# Altium project 28Pins_Project_v1.PrjPcb (part 1 of 3)
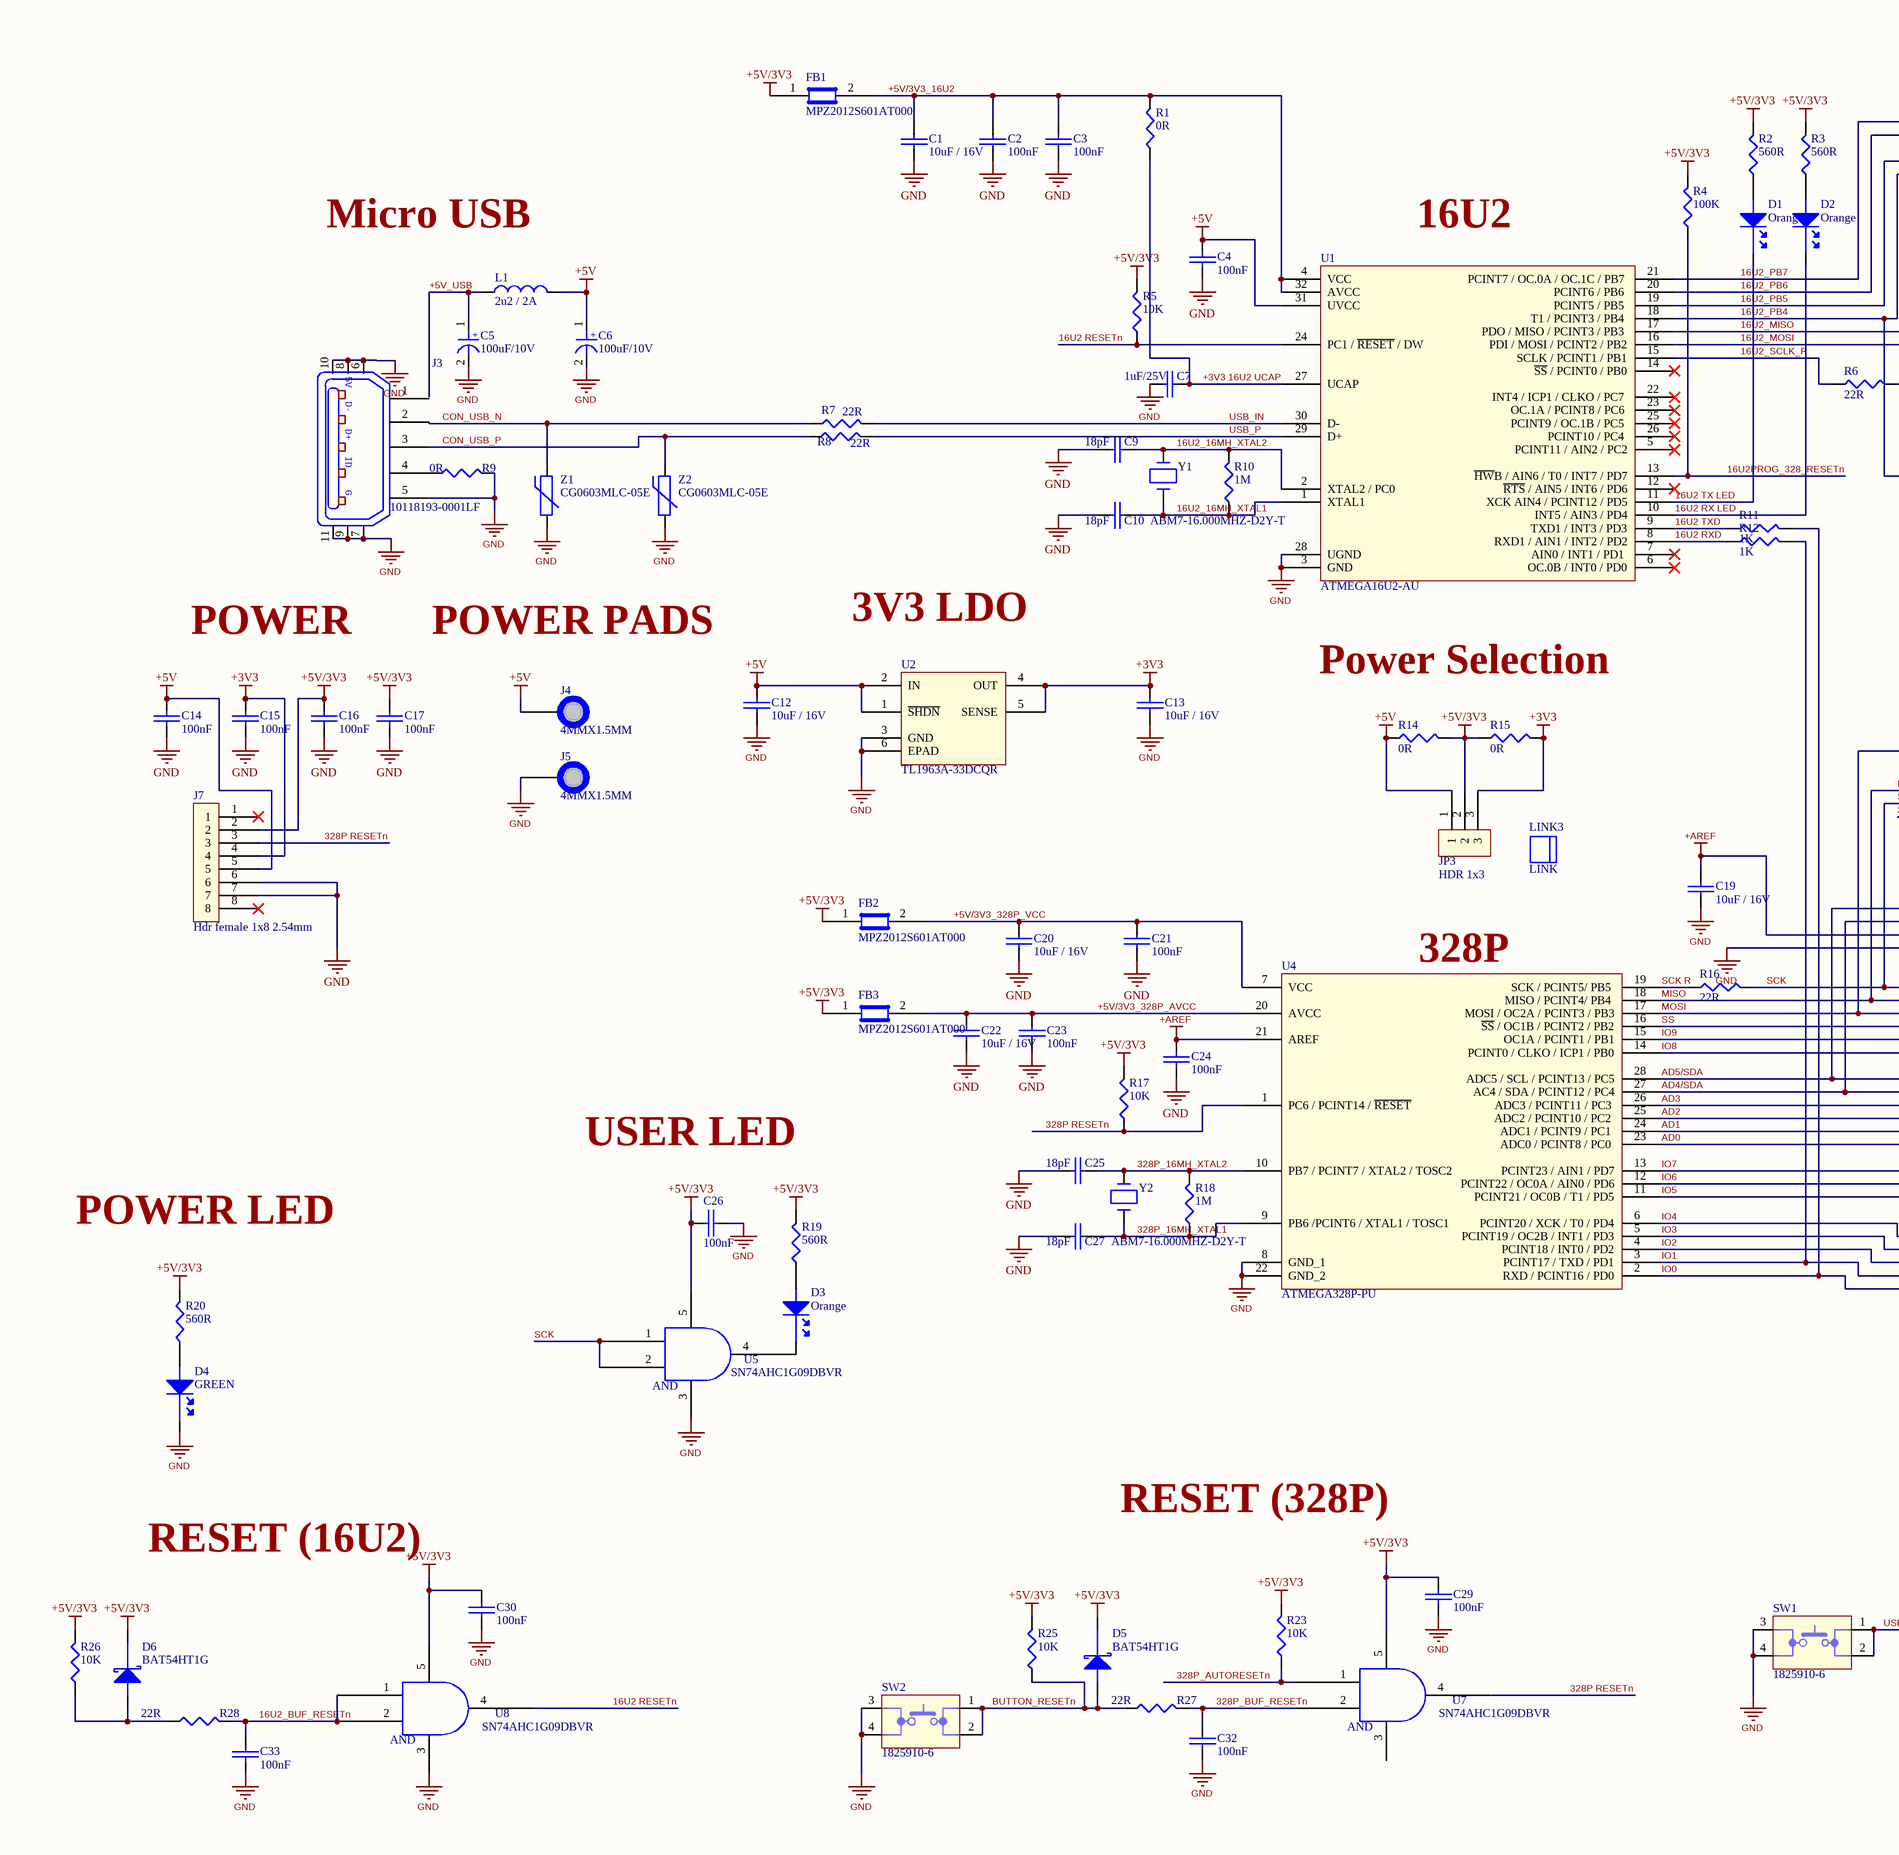
[diagram p0: 28Pins_Schematic.SchDoc, left]
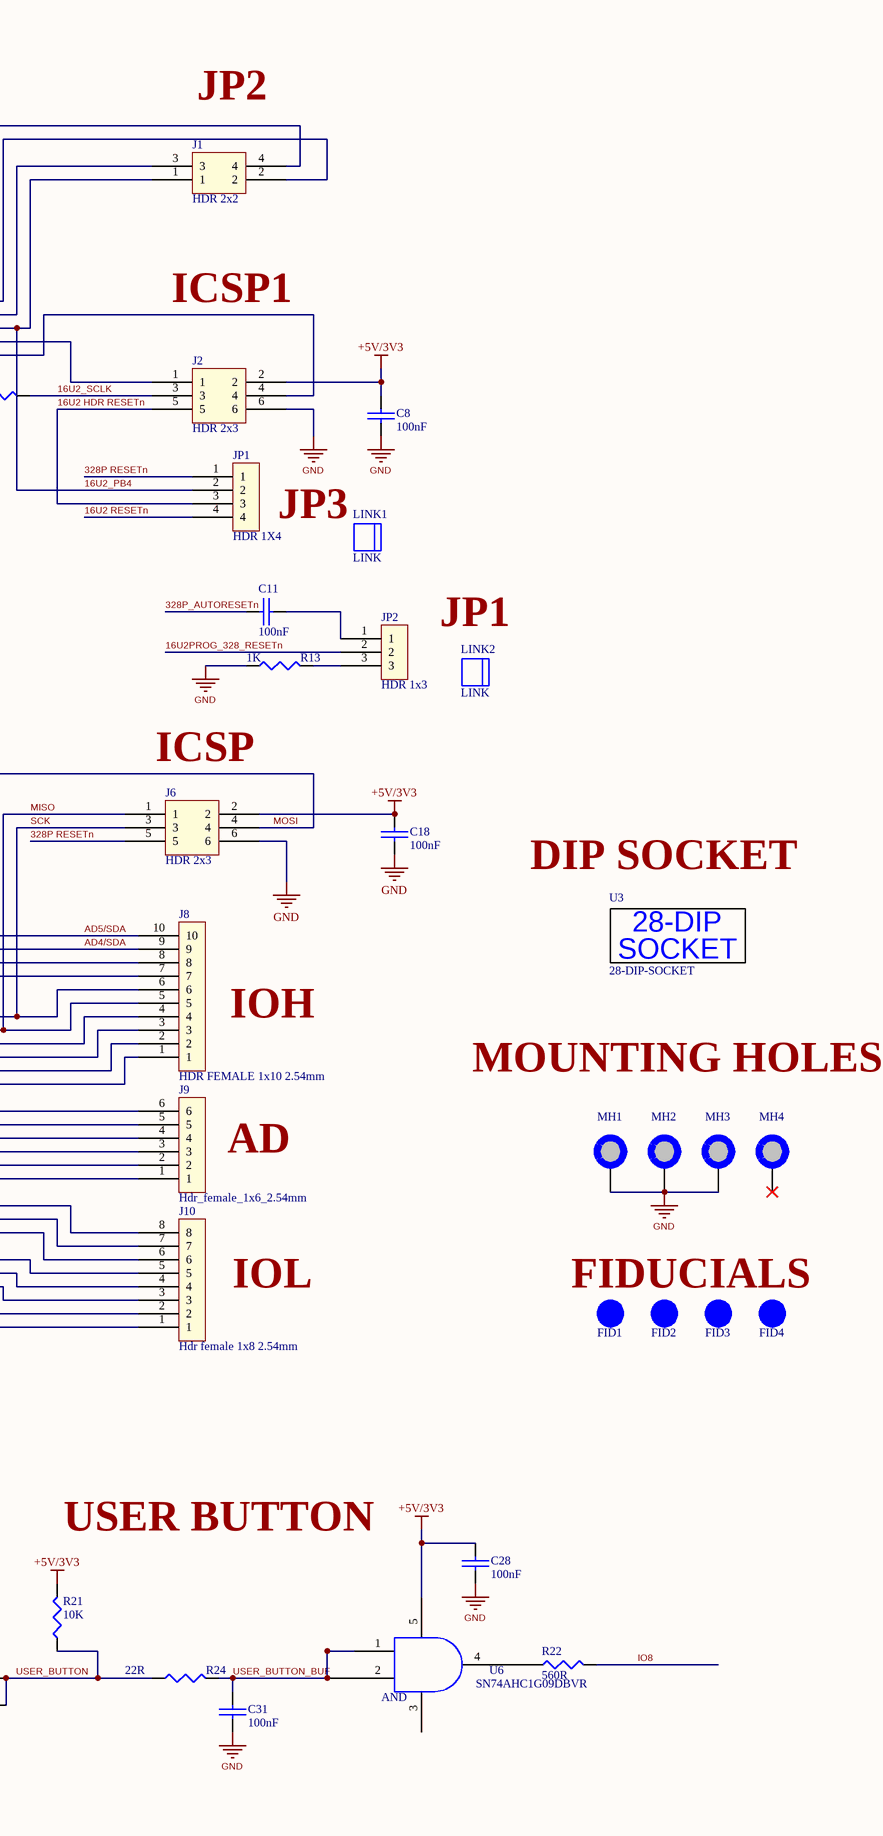
[diagram p1: 28Pins_Schematic.SchDoc, right]
Title: 28_pin_project; NotFitted: NF
1 sheet, 109 parts. Net scope: global (net labels, ports and power ports of the same name join across sheets).
Board file: 28Pins_Project_PCB.PcbDoc

## Sheet 28Pins_Schematic.SchDoc: 28_Pins_project
size A2; DrawnBy: Narayan

### Parts
C1  10uF / 16V  [C0805]
C2  100nF  [C0805]
C3  100nF  [C0805]
C4  100nF  [C0805]
C5  100uF/10V  [C_ALU_C_SIZE]
C6  100uF/10V  [C_ALU_C_SIZE]
C7  1uF/25V  [C0805]
C8  100nF  [C0805]
C9  18pF  [C0805]
C10  18pF  [C0805]
C11  100nF  [C0805]
C12  10uF / 16V  [C0805]
C13  10uF / 16V  [C0805]
C14  100nF  [C0805]
C15  100nF  [C0805]
C16  100nF  [C0805]
C17  100nF  [C0805]
C18  100nF  [C0805]
C19  10uF / 16V  [C0805]
C20  10uF / 16V  [C0805]
C21  100nF  [C0805]
C22  10uF / 16V  [C0805]
C23  100nF  [C0805]
C24  100nF  [C0805]
C25  18pF  [C0805]
C26  100nF  [C0805]
C27  18pF  [C0805]
C28  100nF  [C0805]
C29  100nF  [C0805]
C30  100nF  [C0805]
C31  100nF  [C0805]
C32  100nF  [C0805]
C33  100nF  [C0805]
D1  Orange  [LED_0603]
D2  Orange  [LED_0603]
D3  Orange  [LED_0603]
D4  GREEN  [LED_0603]
D5  BAT54HT1G  [SOD323]
D6  BAT54HT1G  [SOD323]
FB1  MPZ2012S601AT000  [C0805]
FB2  MPZ2012S601AT000  [C0805]
FB3  MPZ2012S601AT000  [C0805]
FID1  FID_1MMC  [FID_40X120D]  (value not drawn)  (no BOM)
FID2  FID_1MMC  [FID_40X120D]  (value not drawn)  (no BOM)
FID3  FID_1MMC  [FID_40X120D]  (value not drawn)  (no BOM)
FID4  FID_1MMC  [FID_40X120D]  (value not drawn)  (no BOM)
J1  HDR 2x2  [HDR _2x2_2.54mm]
J2  HDR 2x3  [HDR _2x3_2.54mm - duplicate]
J3  10118193-0001LF  [10118193]
J4  4MMX1.5MM  [PAD_WITH_HOLE_4MMX1.5MM]  (no BOM)
J5  4MMX1.5MM  [PAD_WITH_HOLE_4MMX1.5MM]  (no BOM)
J6  HDR 2x3  [HDR _2x3_2.54mm - duplicate]
J7  Hdr female 1x8 2.54mm  [Hdr_Female_1x8_2.54mm - duplicate]
J8  HDR FEMALE 1x10 2.54mm  [Hdr_Female_1x10_2.54mm - duplicate]
J9  Hdr_female_1x6_2.54mm  [Hdr_Female_1x6_2.54mm - duplicate - duplicate]
J10  Hdr female 1x8 2.54mm  [Hdr_Female_1x8_2.54mm - duplicate]
JP1  HDR 1X4  [HDR_1X4_2.54mm]
JP2  HDR 1x3  [HDR 1x3 2.54mm]
JP3  HDR 1x3  [HDR 1x3 2.54mm]
L1  2u2 / 2A  [C1210_IND]
LINK1  LINK  (mechanical)
LINK2  LINK  (mechanical)
LINK3  LINK  (mechanical)
MH1  MH_7.4MMC_3.2MMD  [MH_7.4MMD_3.2MMD]  (value not drawn)  (no BOM)
MH2  MH_7.4MMC_3.2MMD  [MH_7.4MMD_3.2MMD]  (value not drawn)  (no BOM)
MH3  MH_7.4MMC_3.2MMD  [MH_7.4MMD_3.2MMD]  (value not drawn)  (no BOM)
MH4  MH_7.4MMNC_3.2MMD  [MH_7.4MMD_3.2MMD_NON_COPPER_NPTH]  (value not drawn)  (no BOM)
R1  0R  [R0805]
R2  560R  [R0805]
R3  560R  [R0805]
R4  100K  [R0805]
R5  10K  [R0805]
R6  22R  [R0805]
R7  22R  [R0805]
R8  22R  [R0805]
R9  0R  [R0805]
R10  1M  [R0805]
R11  1K  [R0805]
R12  1K  [R0805]
R13  1K  [R0805]
R14  0R  [R0805]
R15  0R  [R0805]
R16  22R  [R0805]
R17  10K  [R0805]
R18  1M  [R0805]
R19  560R  [R0805]
R20  560R  [R0805]
R21  10K  [R0805]
R22  560R  [R0805]
R23  10K  [R0805]
R24  22R  [R0805]
R25  10K  [R0805]
R26  10K  [R0805]
R27  22R  [R0805]
R28  22R  [R0805]
SW1  1825910-6  [1825910-6]
SW2  1825910-6  [1825910-6]
U1  ATMEGA16U2-AU  [TQFP32]
U2  TL1963A-33DCQR  [DCQ (R-PDSO-G6)]
U3  28-DIP-SOCKET  [28_DIP_7.62mm_SOCKET]
U4  ATMEGA328P-PU  [28_DIP_7.62m]
U5  SN74AHC1G09DBVR  [DBV_SSOT_23_5]
U6  SN74AHC1G09DBVR  [DBV_SSOT_23_5]
U7  SN74AHC1G09DBVR  [DBV_SSOT_23_5]
U8  SN74AHC1G09DBVR  [DBV_SSOT_23_5]
Y1  ABM7-16.000MHZ-D2Y-T  [ABM7_v1_1_BIG]
Y2  ABM7-16.000MHZ-D2Y-T  [ABM7_v1_1_BIG]
Z1  CG0603MLC-05E  [R0603]
Z2  CG0603MLC-05E  [R0603]

### Nets
+3V3: C13.2 C15.2 J7.4 JP3.3 R15.2 U2.4(OUT) U2.5(SENSE)
+5V: C4.2 C6.1 C12.2 C14.2 J4.1 J7.5 JP3.1 L1.2 R14.1 U1.31(UVCC) U2.1(~{SHDN}) U2.2(IN)
+5V/3V3: C8.1 C16.2 C17.2 C18.2 C26.1 C28.2 C29.2 C30.2 D5.1(Cathode) D6.1(Cathode) FB1.1 FB2.1 FB3.1 J2.2 J6.2 J7.2 JP3.2 R2.2 R3.2 R4.2 R5.2 R14.2 R15.1 R17.2 R19.2 R20.2 R21.2 R23.2 R25.2 R26.2 U5.5 U6.5 U7.5 U8.5
+AREF: C19.2 C24.2 J8.8 U4.21(AREF)
GND: C1.1 C2.1 C3.1 C4.1 C5.2 C6.2 C7.1 C8.2 C9.1 C10.1 C12.1 C13.1 C14.1 C15.1 C16.1 C17.1 C18.1 C19.1 C20.1 C21.1 C22.1 C23.1 C24.1 C25.1 C26.2 C27.1 C28.1 C29.1 C30.1 C31.1 C32.1 C33.1 D4.1(Cathode) J2.6 J3.5(y) J3.6 J3.7 J3.8 J3.9 J3.10 J3.11 J5.1 J6.6 J7.6 J7.7 J8.7 MH1.1 MH2.1 MH3.1 R9.2 R13.1 SW1.3 SW1.4 SW2.3 SW2.4 U1.3(GND) U1.28(UGND) U2.3(GND) U2.6(EPAD) U4.8(GND_1) U4.22(GND_2) U5.3 U8.3 Z1.1 Z2.1
16U2 HDR RESETn: J2.5 JP1.3
16U2 RESETn: JP1.4 R5.1 U1.24(PC1_/_~{RESET}_/_DW) U8.4
16U2 RX LED: D2.1(Cathode) U1.10(INT5_/_AIN3_/_PD4)
16U2 RXD: R12.1 U1.8(RXD1_/_AIN1_/_INT2_/_PD2)
16U2 TX LED: D1.1(Cathode) U1.11(XCK_AIN4_/_PCINT12_/_PD5)
16U2 TXD: R11.1 U1.9(TXD1_/_INT3_/_PD3)
16U2_16MH_XTAL1: C10.2 R10.1 U1.1(XTAL1) Y1.1
16U2_16MH_XTAL2: C9.2 R10.2 U1.2(XTAL2_/_PC0) Y1.2
16U2_BUF_RESETn: C33.2 R28.2 U8.1 U8.2
16U2_MISO: J2.1 U1.17(PDO_/_MISO_/_PCINT3_/_PB3)
16U2_MOSI: J2.4 U1.16(PDI_/_MOSI_/_PCINT2_/_PB2)
16U2_PB4: J1.1 JP1.2 U1.18(T1_/_PCINT3_/_PB4)
16U2_PB5: J1.3 U1.19(PCINT5_/_PB5)
16U2_PB6: J1.2 U1.20(PCINT6_/_PB6)
16U2_PB7: J1.4 U1.21(PCINT7_/_OC.0A_/_OC.1C_/_PB7)
16U2_SCLK: J2.3 R6.2
16U2_SCLK_R: R6.1 U1.15(SCLK_/_PCINT1_/_PB1)
16U2PROG_328_RESETn: JP2.2 R4.1 U1.13(~{HW}B_/_AIN6_/_T0_/_INT7_/_PD7)
328P RESETn: J6.5 J7.3 JP1.1 R17.1 U4.1(PC6_/_PCINT14_/_~{RESET}) U7.4
328P_16MH_XTAL1: C27.2 R18.1 U4.9(PB6_/PCINT6_/_XTAL1_/_TOSC1) Y2.1
328P_16MH_XTAL2: C25.2 R18.2 U4.10(PB7_/_PCINT7_/_XTAL2_/_TOSC2) Y2.2
328P_AUTORESETn: C11.1 R23.1 U7.1
328P_BUF_RESETn: C32.2 R27.2 U7.2
+3V3 16U2 UCAP: C7.2 R1.1 U1.27(UCAP)
+5V/3V3_16U2: C1.2 C2.2 C3.2 FB1.2 R1.2 U1.4(VCC) U1.32(AVCC)
+5V/3V3_328P_AVCC: C22.2 C23.2 FB3.2 U4.20(AVCC)
+5V/3V3_328P_VCC: C20.2 C21.2 FB2.2 U4.7(VCC)
+5V_USB: C5.1 L1.1
AD0: J9.1 U4.23(ADC0_/_PCINT8_/_PC0)
AD1: J9.2 U4.24(ADC1_/_PCINT9_/_PC1)
AD2: J9.3 U4.25(ADC2_/_PCINT10_/_PC2)
AD3: J9.4 U4.26(ADC3_/_PCINT11_/_PC3)
AD4/SDA: J8.9 J9.5 U4.27(AC4_/_SDA_/_PCINT12_/_PC4)
AD5/SDA: J8.10 J9.6 U4.28(ADC5_/_SCL_/_PCINT13_/_PC5)
BUTTON_RESETn: D5.2(Anode) R25.1 R27.1 SW2.1 SW2.2
CON_USB_N: J3.2 R7.1 Z1.2
CON_USB_P: J3.3 R8.1 Z2.2
IO0: J10.1 R11.2 U4.2(RXD_/_PCINT16_/_PD0)
IO1: J10.2 R12.2 U4.3(PCINT17_/_TXD_/_PD1)
IO2: J10.3 U4.4(PCINT18_/_INT0_/_PD2)
IO3: J10.4 U4.5(PCINT19_/_OC2B_/_INT1_/_PD3)
IO4: J10.5 U4.6(PCINT20_/_XCK_/_T0_/_PD4)
IO5: J10.6 U4.11(PCINT21_/_OC0B_/_T1_/_PD5)
IO6: J10.7 U4.12(PCINT22_/_OC0A_/_AIN0_/_PD6)
IO7: J10.8 U4.13(PCINT23_/_AIN1_/_PD7)
IO8: J8.1 R22.2 U4.14(PCINT0_/_CLKO_/_ICP1_/_PB0)
IO9: J8.2 U4.15(OC1A_/_PCINT1_/_PB1)
MISO: J6.1 J8.5 U4.18(MISO_/_PCINT4/_PB4)
MOSI: J6.4 J8.4 U4.17(MOSI_/_OC2A_/_PCINT3_/_PB3)
SCK: J6.3 J8.6 R16.2 U5.1 U5.2
SCK R: R16.1 U4.19(SCK_/_PCINT5/_PB5)
SS: J8.3 U4.16(~{SS}_/_OC1B_/_PCINT2_/_PB2)
USB_IN: R7.2 U1.30(D-)
USB_P: R8.2 U1.29(D+)
USER_BUTTON: R21.1 R24.1 SW1.1 SW1.2
USER_BUTTON_BUF: C31.2 R24.2 U6.1 U6.2
NetC11_2: C11.2 JP2.1
NetD1_2: D1.2(Anode) R2.1
NetD2_2: D2.2(Anode) R3.1
NetD3_1: D3.1(Cathode) U5.4
NetD3_2: D3.2(Anode) R19.1
NetD4_2: D4.2(Anode) R20.1
NetD6_2: D6.2(Anode) R26.1 R28.1
NetJ3_4: J3.4 R9.1
NetJP2_3: JP2.3 R13.2
NetR22_1: R22.1 U6.4

Not connected (* = marked no-connect by the designer): J3 1; J7 1* 8*; MH4 1*; U1 5(PCINT11_/_AIN2_/_PC2)* 6(OC.0B_/_INT0_/_PD0)* 7(AIN0_/_INT1_/_PD1_)* 12(~{RTS}_/_AIN5_/_INT6_/_PD6)* 14(~{SS}_/_PCINT0_/_PB0)* 22(INT4_/_ICP1_/_CLKO_/_PC7_)* 23(OC.1A_/_PCINT8_/_PC6_)* 25(PCINT9_/_OC.1B_/_PC5_)* 26(PCINT10_/_PC4_)*; U6 3; U7 3

### Notes on the sheet
- JP2
- Micro USB
- (near U1) 16U2
- ICSP1
- (near LINK1) JP3
- 3V3 LDO
- (near LINK2) JP1
- POWER
- POWER PADS
- Power Selection
- ICSP
- (near U3) DIP SOCKET
- (near U4) 328P
- IOH
- MOUNTING HOLES
- USER LED
- AD
- POWER LED
- IOL
- FIDUCIALS
- RESET (328P)
- USER BUTTON
- RESET (16U2)
- (in symbol 4828-3004-CP) 28-DIP; SOCKET
- (in symbol 10118193-0001LF) 5V; D-; D+; ID; G
- (in symbol EEE-1AA101WR) +